# Altium schematic sheet [6]_MOT_H-BDIGDE FOC.SchDoc
size A3; DocumentNumber: 6; SheetNumber: 6; SheetTotal: 12; Ngu?i ki?m tra: bangdd; Ngu?i thi?t k?: thannt114
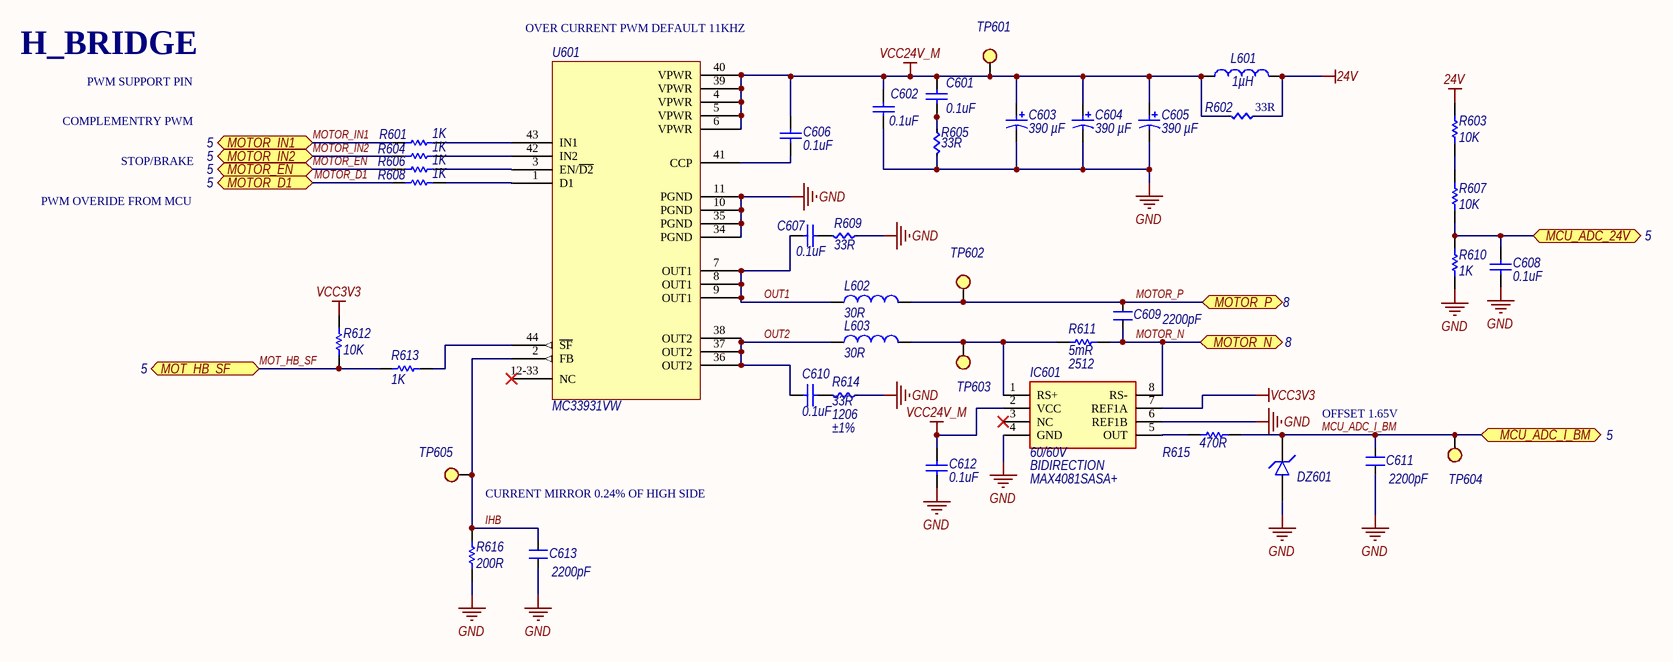
[diagram p0: [6]_MOT_H-BDIGDE FOC.SchDoc]

## Parts
C601  0.1uF  [CAP 0603]
C602  0.1uF  [CAP 0603]
C603  CPACITANCE: 390 µF  [MAL218397005E3]  (hidden comment: HTK-35V391MHC5E-R2)
C604  CPACITANCE: 390 µF  [MAL218397005E3]  (hidden comment: HTK-35V391MHC5E-R2)
C605  CPACITANCE: 390 µF  [MAL218397005E3]  (hidden comment: HTK-35V391MHC5E-R2)
C606  0.1uF  [CAP 0603]
C607  0.1uF  [CAP 0603]
C608  0.1uF  [CAP 0603]
C609  2200pF  [CAP 0603]
C610  0.1uF  [CAP 0603]
C611  2200pF  [CAP 0603]
C612  0.1uF  [CAP 0603]
C613  2200pF  [CAP 0603]
DZ601  ESD8351HT1G  [SOD-323]  (value not drawn)
IC601  GAIN: 60/60V  FUNCTION: BIDIRECTION  [8-SOIC]  (hidden comment: MAX4081SASA+)
L601  1µH  [IND 11.5x10x4mm]
L602  30R  [R0805]
L603  30R  [R0805]
R601  1K  [res 0603]
R602  33R  [RES 1206]
R603  10K  [res 0603]
R604  1K  [res 0603]
R605  33R  [RES 1206]
R606  1K  [res 0603]
R607  10K  [res 0603]
R608  1K  [res 0603]
R609  33R  [RES 1206]
R610  1K  [res 0603]
R611  value 5mR  PCB Footprint: 2512  [res 2512]  (hidden comment: CRF2512-FZ-R005ELF)
R612  10K  [res 0603]
R613  1K  [res 0603]
R614  33R  PACKAGE: 1206  Tolerance: ±1%  [RES 1206]
R615  470R  [res 0603]
R616  200R  [res 0603]
TP601  TP SMD  [TESTPOINT]  (value not drawn)  (no BOM)
TP602  TP SMD  [TESTPOINT]  (value not drawn)  (no BOM)
TP603  TP SMD  [TESTPOINT]  (value not drawn)  (no BOM)
TP604  TP SMD  [TESTPOINT]  (value not drawn)  (no BOM)
TP605  TP SMD  [TESTPOINT]  (value not drawn)  (no BOM)
U601  MC33931VW  [SOP44_FRE-M]

## Ports
MCU_ADC_24V (bidir, see 5), MCU_ADC_I_BM (bidir, see 5), MOT_HB_SF (bidir, see 5), MOTOR_D1 (bidir, see 5), MOTOR_EN (bidir, see 5), MOTOR_IN1 (bidir, see 5), MOTOR_IN2 (bidir, see 5), MOTOR_N (bidir, see 8), MOTOR_P (bidir, see 8)

## Nets
24V: L601.1 R602.1 R603.2
GND: C602.2 C603.2 C604.2 C605.2 C608.2 C611.2 C612.2 C613.2 DZ601.2 IC601.4(GND) IC601.6(REF1B) R605.2 R609.2 R610.2 R614.2 R616.1 U601.10(PGND) U601.11(PGND) U601.34(PGND) U601.35(PGND)
VCC3V3: IC601.7(REF1A) R612.1
VCC24V_M: C601.1 C602.1 C603.1 C604.1 C605.1 C606.1 C612.1 IC601.2(VCC) L601.2 R602.2 TP601.1 U601.4(VPWR) U601.5(VPWR) U601.6(VPWR) U601.39(VPWR) U601.40(VPWR)
IHB: C613.1 R616.2 TP605.1 U601.2(FB)
MCU_ADC_24V: C608.1 R607.1 R610.1 ; port MCU_ADC_24V
MCU_ADC_I_BM: C611.1 DZ601.1 R615.2 TP604.1 ; port MCU_ADC_I_BM
MOT_HB_SF: R612.2 R613.1 ; port MOT_HB_SF
MOTOR_D1: R608.1 ; port MOTOR_D1
MOTOR_EN: R606.1 ; port MOTOR_EN
MOTOR_IN1: R601.1 ; port MOTOR_IN1
MOTOR_IN2: R604.1 ; port MOTOR_IN2
MOTOR_N: C609.2 IC601.8(RS-) R611.2 ; port MOTOR_N
MOTOR_P: C609.1 L602.2 TP602.1 ; port MOTOR_P
OUT1: C607.1 L602.1 U601.7(OUT1) U601.8(OUT1) U601.9(OUT1)
OUT2: C610.1 L603.1 U601.36(OUT2) U601.37(OUT2) U601.38(OUT2)
NetC601_2: C601.2 R605.1
NetC606_2: C606.2 U601.41(CCP)
NetC607_2: C607.2 R609.1
NetC610_2: C610.2 R614.1
NetIC601_1: IC601.1(RS+) L603.2 R611.1 TP603.1
NetIC601_5: IC601.5(OUT) R615.1
NetR601_2: R601.2 U601.43(IN1)
NetR603_1: R603.1 R607.2
NetR604_2: R604.2 U601.42(IN2)
NetR606_2: R606.2 U601.3(EN/~{D2})
NetR608_2: R608.2 U601.1(D1)
NetR613_2: R613.2 U601.44(~{SF})

Not connected (* = marked no-connect by the designer): IC601 3(NC)*; U601 12-33(NC)*

## Notes on the sheet
- H_BRIDGE
- (near U601) OVER CURRENT PWM DEFAULT 11KHZ
- COMPLEMENTRY PWM
- PWM SUPPORT PIN
- PWM OVERIDE FROM MCU
- STOP/BRAKE
- OFFSET 1.65V
- CURRENT MIRROR 0.24% OF HIGH SIDE

## Library data of the parts
C601 C602 C606-C608 C610 C612 = Cap: CAP-CER,SMD;0.1UF,10%,50V,X7R,0603; MANUFACTURER1: Samsung Electro-Mechanics; MANUFACTURER1_PART#: CL10B104KB8NNNC; MANUFACTURER2_PART#: M0603X104K050TAX; MANUFACTURER1: SS; Unit: PCS; PACKING: Tape & Reel (TR); PCB FOOTPRINT: 0603; Process Type: SM; CATEGORY: CAP-CER; VALUE: 0.1uF; FOOTPRINT: 0603; Material: X7R; Voltage: 50V; Tolerance: ±10%; MANUFACTURER2: UWA
C603-C605 = CAP-ALUM,SMD;470uF,20%,12.5x30,63V,287mOhm: HYBRID ECAP, 35V, 390UF, 30G VIB; MANUFACTURER1: Elna America; VOLTAGE: 63V; ESR: 18mOhm; Lifetime @ Temp.: 6000 Hrs @ 125°C; RIPPLE CURRENT: 3 A @ 100 kHz; Manufacturer Part Number: MAL218397005E3; Category: CAP-POLY-SMD; MANUFACTURER1_PART#: HTK-35V391MHC5E-R2; VALUE: HTK-35V391MHC5E-R2; LINK: https://www.digikey.com/en/products/detail/elna-america/HTK-35V391MHC5E-R2/10129270; PRICE: 1.732
C609 C611 C613 = CN: CAP CER 2200PF 50V X7R 0603; MANUFACTURER1: Samsung Electro-Mechanics; MANUFACTURER1_PART#: CL10B222KB8NFNC; PACKING: TR; PCB FOOTPRINT: 0603; PROCESS_TYPE: SMT; Tolerance: ±10%; Value: 2200pF; CATEGORY: CAP CER; Voltage - Rated: 50V; Temperature Coefficient: X7R
DZ601 = TVS-DIODE;BI-DIR,600W,30V/48.4V,DO214AA,SMBJ30A-E3/52: TVS DIODE 3.3VWM 11.2VC SOD323; MANUFACTURER1: onsemi; Voltage - Reverse Standoff: 3.3V; Power - Peak Pulse: 250W; Category: TVS; MANUFACTURER1_PART#: ESD8351HT1G; VALUE: ESD8351HT1G; LINK: https://www.digikey.com/en/products/detail/onsemi/ESD8351HT1G/5257577; PRICE: 0.16
IC601 = IC; IC CURR SENSE 1 CIRCUIT,8-SOIC,-40TO 125°C,LT1999HMS8-20#PBF: IC CURR SENSE 1 CIRCUIT 8SOIC; MANUFACTURER1: Maxim; Manufacturer Part Number: MAX4081SASA+; PRICE: 3.05000; MANUFACTURER1_PART#: MAX4081SASA+; LINK: https://www.digikey.com/en/products/detail/maxim-integrated/MAX4080SASA-T/1703910; Category: IC; NI_MARK: *; VALUE: MAX4081SASA+; MANUFACTURER2: *; MANUFACTURER2_PART#: *
L601 = inductor 2.2uF: FIXED IND 1UH 17.5A 4.1 MOHM SMD; MANUFACTURER1: Mag Layers; MANUFACTURER1_PART#: MMD-10DZ-1R0M-V1-RU; PACKING: Tape & Reel (TR); PCB Footprint: (11.50mm x 10.00mm); Process Type: SM; Unit: PCS; Tolerance: ±20%; SAT CURENT: 5.6A; Category: Inductor; RATE Current: 17.5A; Value: 1µH; PRICE: 0.78000; LINK: https://www.digikey.com/en/products/detail/mag-layers/MMD-10DZ-1R0M-V1-RU/12182209
L602 L603 = inductor 2.2uF: FIXED IND 6.8UH 2.3A 52 MOHM SMD; MANUFACTURER1: Murata; MANUFACTURER1_PART#: BLM21SN300SH1D; PACKING: Tape & Reel (TR); PCB Footprint: 0805; Process Type: SM; Unit: PCS; Current: 6A; Tolerance: ±20%; CORE TYPE: FERRITE; Category: Inductor; Value: 30R
R601 R604 R606 R608 R610 R613 = Res0.3: RES SMD,1K OHM,5%,1/10W,0603; MANUFACTURER1: Stackpole Electronics Inc; MANUFACTURER1_PART#: RMCF06031K00JNEAC; MANUFACTURER2_PART#: R0603J1KTG; DESCCRIPTION: RES SMD 1K OHM 5% 1/10W 0603; PACKING: Tape & Reel (TR); PCB Footprint: 0603; Process Type: SM; Unit: PCS; LOH_Code: 140100083; Power: 0.25W; Value: 1K; CATEGORY: RES SMD; MANUFACTURER2: UWA; Tolerance: ±5%
R602 R605 R609 R614 = RES 510R 1206 5%: RES 33 OHM 1% 1/4W 1206; MANUFACTURER1: Stackpole; MANUFACTURER1_PART#: RMCF1206FT33R0; PROCESS_TYPE: SMT; Power (Watts): 1/2W; Packaging: Tape and Reel; CATEGORY: RES; VALUE: 33R
  R602 R605 R609: PACKAGE: 1206; Tolerance: ±1%
R603 R607 R612 = Res0.3: RES SMD,10K OHM 5% 1/10W 0603; MANUFACTURER1: Stackpole Electronics Inc; MANUFACTURER1_PART#: RMCF0603JT10K0; MANUFACTURER2_PART#: R0603J10KKDX; PACKING: Tape & Reel (TR); PCB Footprint: 0603; Process Type: SM; Unit: PCS; Power: 0.25W; Value: 10K; CATEGORY: RES-SMD; MANUFACTURER2: UWA; Tolerance: ±5%
R611 = Res0.3: RES 0.005 OHM 1% 2W 2512; MANUFACTURER1: Bourns; PACKING: Tape & Reel (TR); Process Type: SM; Unit: PCS; CATEGORY: RES SMD; MANUFACTURER1_PART#: CRF2512-FZ-R005ELF
R615 = Res0.3: RES SMD, 470 OHM 5% 1/8W 0603; MANUFACTURER1: KOA Speer Electronics, Inc.; MANUFACTURER1_PART#: RK73B1JTTD471J; MANUFACTURER2_PART#: RMCF0603JT470R; PACKING: Tape & Reel (TR); PCB Footprint: 0603; Process Type: SM; Unit: PCS; Power: 0.25W; Value: 470R; CATEGORY: RES SMD; MANUFACTURER2: Stackpole; Tolerance: ±5%
R616 = Res0.3: RES 200 OHM 1% 1/8W 0603; MANUFACTURER1: Stackpole Electronics Inc; MANUFACTURER1_PART#: RNCP0603FTD200R; MANUFACTURER2_PART#: RC0603FR-07200RL; DESCCRIPTION: RES SMD 1K OHM 5% 1/10W 0603; PACKING: Tape & Reel (TR); PCB Footprint: 0603; Process Type: SM; Unit: PCS; Power: 0.25W; Value: 200R; CATEGORY: RES SMD; MANUFACTURER2: YAGEO; Tolerance: ±1%
TP601-TP605 = TP SMD: TEST POINT
U601 = MC33931VW IC MOTOR DRIVER 5V-28V 44HSOP: IC MOTOR DRIVER 5V-28V 44HSOP; MANUFACTURER1: NXP; CURRENT: 5A; MAX INPUT: 28V; THERMAL RESISTANCE: 1*C/W; LOH_CODE: *; MANUFACTURER1_PART#: MC33931VW; Value: MC33931VW; PRICE: 13.54000; LINK: https://www.digikey.com/en/products/detail/nxp-usa-inc/MC33931VW/2185657